# EAGLE design KimCard (EAGLE 5.08)
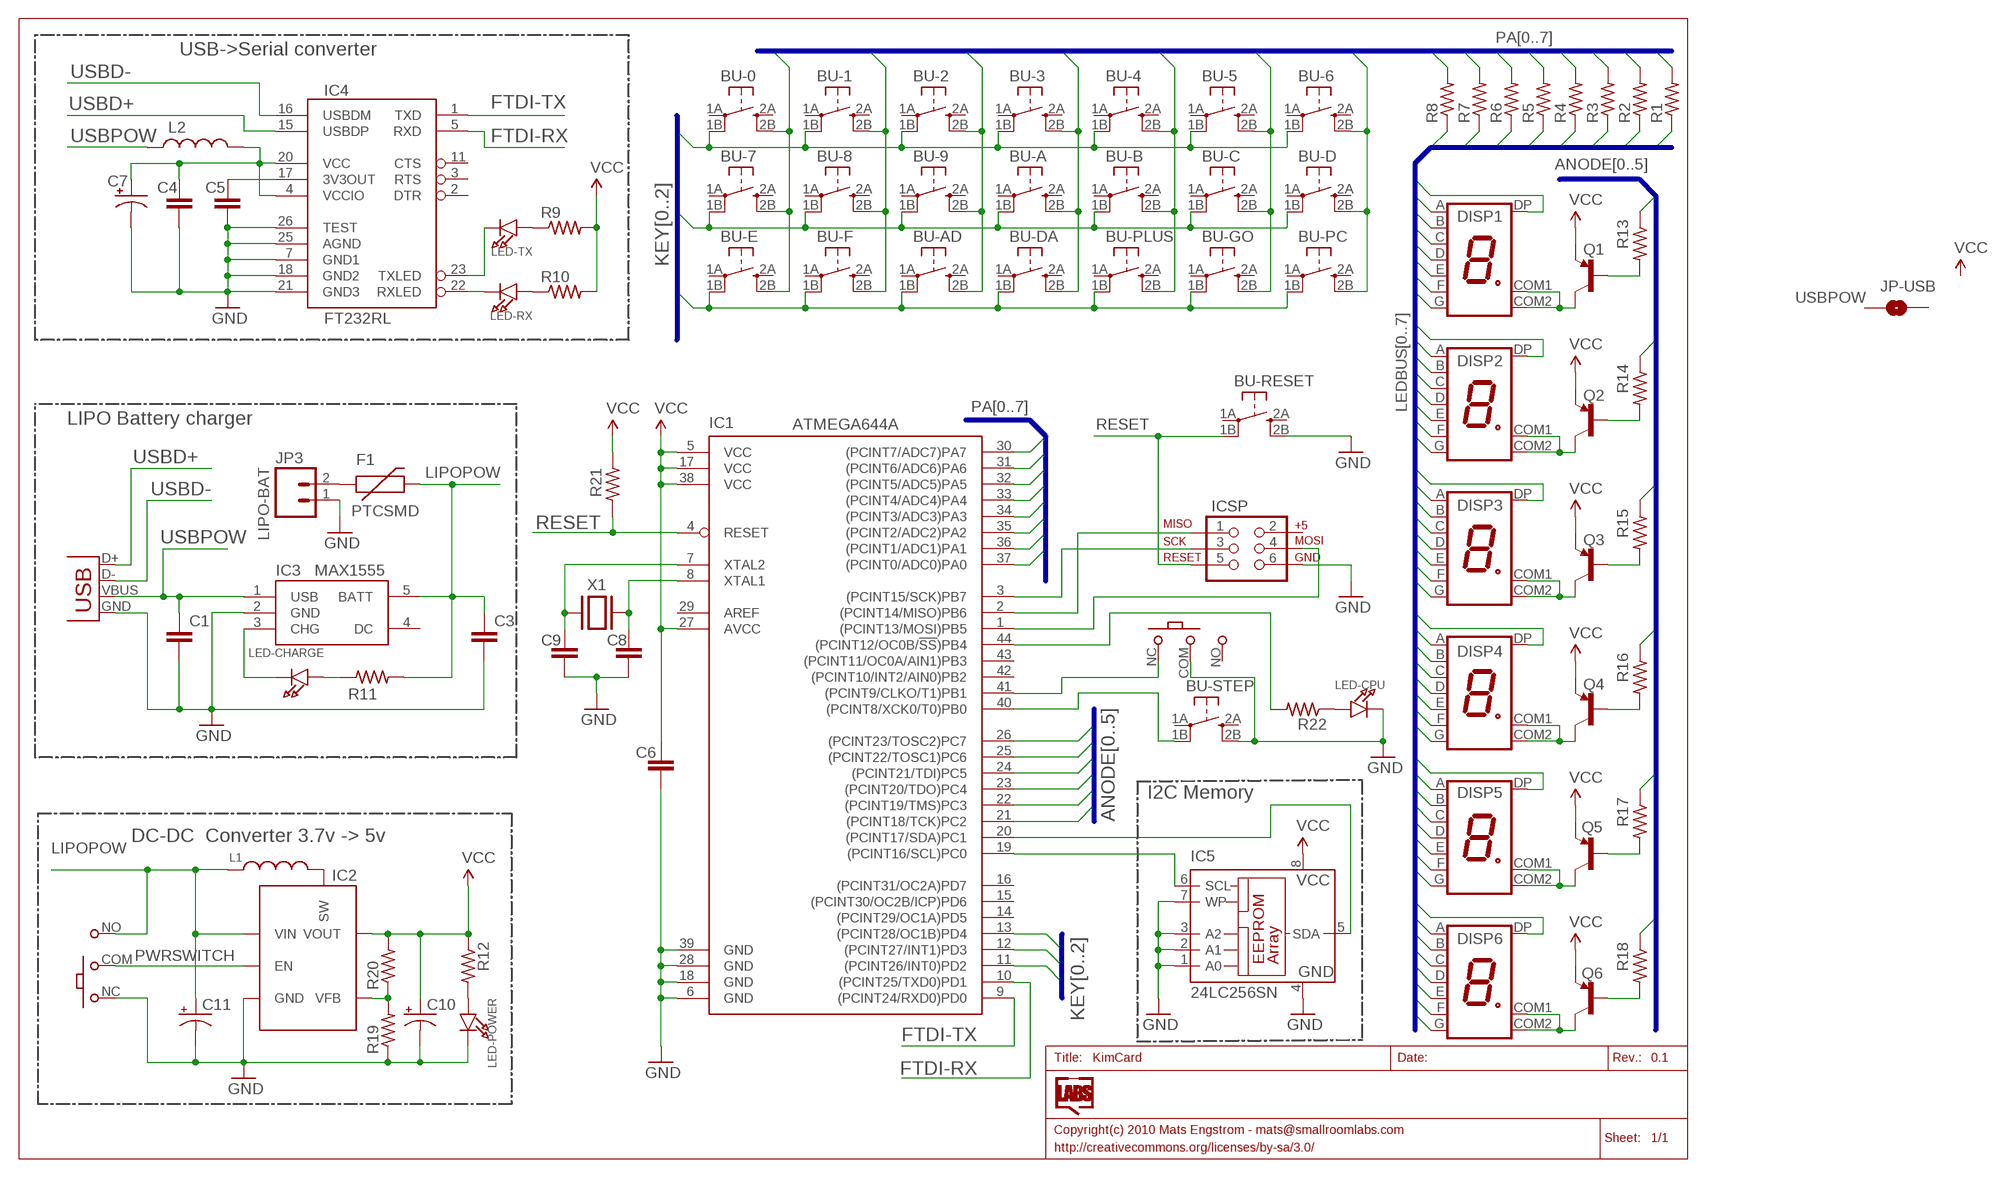
[diagram p0: schematic, sheet 1]

## Parts
BU-0  TACTILE  [EVQ-Q2]
BU-1  TACTILE  [EVQ-Q2]
BU-2  TACTILE  [EVQ-Q2]
BU-3  TACTILE  [EVQ-Q2]
BU-4  TACTILE  [EVQ-Q2]
BU-5  TACTILE  [EVQ-Q2]
BU-6  TACTILE  [EVQ-Q2]
BU-7  TACTILE  [EVQ-Q2]
BU-8  TACTILE  [EVQ-Q2]
BU-9  TACTILE  [EVQ-Q2]
BU-A  TACTILE  [EVQ-Q2]
BU-AD  TACTILE  [EVQ-Q2]
BU-B  TACTILE  [EVQ-Q2]
BU-C  TACTILE  [EVQ-Q2]
BU-D  TACTILE  [EVQ-Q2]
BU-DA  TACTILE  [EVQ-Q2]
BU-E  TACTILE  [EVQ-Q2]
BU-F  TACTILE  [EVQ-Q2]
BU-GO  TACTILE  [EVQ-Q2]
BU-PC  TACTILE  [EVQ-Q2]
BU-PLUS  TACTILE  [EVQ-Q2]
BU-RESET  TACTILE  [EVQ-Q2]
BU-STEP  TACTILE  [EVQ-Q2]
C1  CAP0805  [0805]
C3  CAP0805  [0805]
C4  CAP0603-CAP  [0603-CAP]
C5  CAP0603-CAP  [0603-CAP]
C6  CAP0603-CAP  [0603-CAP]
C7  CAP_POL1206  [EIA3216]
C8  CAP0603-CAP  [0603-CAP]
C9  CAP0603-CAP  [0603-CAP]
C10  CAP_POL1206  [EIA3216]
C11  CAP_POL1206  [EIA3216]
DISP1  7SEG  [TDS11]
DISP2  7SEG  [TDS11]
DISP3  7SEG  [TDS11]
DISP4  7SEG  [TDS11]
DISP5  7SEG  [TDS11]
DISP6  7SEG  [TDS11]
F1  PTCSMD  [PTC-1206]
IC1  ATMEGA644A  [TQFP44]
IC2  MCP1640SOT23-6  [SOT23-6]
IC3  MAX1555  [SOT23-5]
IC4  FT232RL  FT232RL-BASICSSOP  [SSOP28DB]
IC5  24LC256SN  [SO-08]
ICSP  AVR-ISP6AVRISP-EXTENED  [HEADER-2X3-EXTENDED]
JP1  USB-IN  USBSMD  [USB-MINIB]
JP3  LIPO-BAT  M02-JST-2MM-SMT  [S2B-PH]
JP-USB  SOLDERJUMPERNO  [SJ_2S-NO]
L1  INDUCTOR-VLCF  [VLCF]
L2  INDUCTOR0603  [0603]
LED-CHARGE  LEDSMD0805  [CHIPLED_0805]
LED-CPU  LEDSMD0805  [CHIPLED_0805]
LED-POWER  LEDSMD0805  [CHIPLED_0805]
LED-RX  LEDSMD0805  [CHIPLED_0805]
LED-TX  LEDSMD0805  [CHIPLED_0805]
Q1  TRANSISTOR_PNPSMD  [SOT23-3]
Q2  TRANSISTOR_PNPSMD  [SOT23-3]
Q3  TRANSISTOR_PNPSMD  [SOT23-3]
Q4  TRANSISTOR_PNPSMD  [SOT23-3]
Q5  TRANSISTOR_PNPSMD  [SOT23-3]
Q6  TRANSISTOR_PNPSMD  [SOT23-3]
R1  R-US_R0805  [R0805]
R2  R-US_R0805  [R0805]
R3  R-US_R0805  [R0805]
R4  R-US_R0805  [R0805]
R5  R-US_R0805  [R0805]
R6  R-US_R0805  [R0805]
R7  R-US_R0805  [R0805]
R8  R-US_R0805  [R0805]
R9  R-US_R0805  [R0805]
R10  R-US_R0805  [R0805]
R11  R-US_R0805  [R0805]
R12  R-US_R0805  [R0805]
R13  R-US_R0805  [R0805]
R14  R-US_R0805  [R0805]
R15  R-US_R0805  [R0805]
R16  R-US_R0805  [R0805]
R17  R-US_R0805  [R0805]
R18  R-US_R0805  [R0805]
R19  R-US_R0805  [R0805]
R20  R-US_R0805  [R0805]
R21  R-US_R0805  [R0805]
R22  R-US_R0805  [R0805]
U$1  SLIDESWITCHPCM12SMTR  [PCM12SMTR]
U$2  SLIDESWITCHPCM12SMTR  [PCM12SMTR]
X1  XTAL12SMX-B  [12SMX-B]

## Nets
FTDI-RX: IC1.10((PCINT25/TXD0)PD1) IC4.5(RXD)
FTDI-TX: IC1.9((PCINT24/RXD0)PD0) IC4.1(TXD)
GND [pwr2]: BU-RESET.2B BU-STEP.2B C1.2 C3.2 C4.2 C5.2 C6.1 C7.C(-) C8.1 C9.1 C10.C(-) C11.C(-) IC1.6(GND) IC1.18(GND) IC1.28(GND) IC1.39(GND) IC2.2(GND) IC3.2(GND) IC4.7(GND1) IC4.18(GND2) IC4.21(GND3) IC4.25(AGND) IC4.26(TEST) IC5.1(A0) IC5.2(A1) IC5.3(A2) IC5.4(GND) IC5.7(WP) ICSP.6(GND) JP1.GND JP3.1 LED-CPU.C LED-POWER.C R19.1 U$1.NC U$2.COM
KEYROW0: BU-0.1B BU-1.1B BU-2.1B BU-3.1B BU-4.1B BU-5.1B BU-6.1B IC1.11((PCINT26/INT0)PD2)
KEYROW1: BU-7.1B BU-8.1B BU-9.1B BU-A.1B BU-B.1B BU-C.1B BU-D.1B IC1.12((PCINT27/INT1)PD3)
KEYROW2: BU-AD.1B BU-DA.1B BU-E.1B BU-F.1B BU-GO.1B BU-PC.1B BU-PLUS.1B IC1.13((PCINT28/OC1B)PD4)
LEDBUS0: DISP1.A DISP2.A DISP3.A DISP4.A DISP5.A DISP6.A R1.1
LEDBUS1: DISP1.B DISP2.B DISP3.B DISP4.B DISP5.B DISP6.B R2.1
LEDBUS2: DISP1.C DISP2.C DISP3.C DISP4.C DISP5.C DISP6.C R3.1
LEDBUS3: DISP1.D DISP2.D DISP3.D DISP4.D DISP5.D DISP6.D R4.1
LEDBUS4: DISP1.E DISP2.E DISP3.E DISP4.E DISP5.E DISP6.E R5.1
LEDBUS5: DISP1.F DISP2.F DISP3.F DISP4.F DISP5.F DISP6.F R6.1
LEDBUS6: DISP1.G DISP2.G DISP3.G DISP4.G DISP5.G DISP6.G R7.1
LEDBUS7: DISP1.DP DISP2.DP DISP3.DP DISP4.DP DISP5.DP DISP6.DP R8.1
LEDCA0: IC1.21((PCINT18/TCK)PC2) R13.1
LEDCA1: IC1.22((PCINT19/TMS)PC3) R14.1
LEDCA2: IC1.23((PCINT20/TDO)PC4) R15.1
LEDCA3: IC1.24((PCINT21/TDI)PC5) R16.1
LEDCA4: IC1.25((PCINT22/TOSC1)PC6) R17.1
LEDCA5: IC1.26((PCINT23/TOSC2)PC7) R18.1
LIPO+ [pwr1]: F1.1 JP3.2
LIPOPOW [pwr2]: C3.1 C11.A(+) F1.2 IC2.6(VIN) IC3.5(BATT) L1.P$1 R11.2 U$1.NO
MISO: IC1.2((PCINT14/MISO)PB6) ICSP.1(MISO)
MOSI: IC1.1((PCINT13/MOSI)PB5) ICSP.4(MOSI)
N$1: IC2.1(SW) L1.P$2
N$2: IC1.41((PCINT9/CLKO/T1)PB1) U$2.NC
N$4: LED-TX.A R9.1
N$5: LED-RX.A R10.1
N$6: LED-POWER.A R12.2
N$7: LED-CPU.A R22.1
N$15: IC2.4(VFB) R19.2 R20.1
N$18: IC3.3(CHG) LED-CHARGE.C
N$19: BU-STEP.1B IC1.40((PCINT8/XCK0/T0)PB0)
N$21: C5.1 IC4.17(3V3OUT)
N$23: IC1.19((PCINT16/SCL)PC0) IC5.6(SCL)
N$24: IC1.20((PCINT17/SDA)PC1) IC5.5(SDA)
N$25: IC1.44((PCINT12/OC0B/!SS!)PB4) R22.2
N$29: IC4.22(RXLED) LED-RX.C
N$30: IC4.23(TXLED) LED-TX.C
PA0: BU-0.2B BU-7.2B BU-E.2B IC1.37((PCINT0/ADC0)PA0) R1.2
PA1: BU-1.2B BU-8.2B BU-F.2B IC1.36((PCINT1/ADC1)PA1) R2.2
PA2: BU-2.2B BU-9.2B BU-AD.2B IC1.35((PCINT2/ADC2)PA2) R3.2
PA3: BU-3.2B BU-A.2B BU-DA.2B IC1.34((PCINT3/ADC3)PA3) R4.2
PA4: BU-4.2B BU-B.2B BU-PLUS.2B IC1.33((PCINT4/ADC4)PA4) R5.2
PA5: BU-5.2B BU-C.2B BU-GO.2B IC1.32((PCINT5/ADC5)PA5) R6.2
PA6: BU-6.2B BU-D.2B BU-PC.2B IC1.31((PCINT6/ADC6)PA6) R7.2
PA7: IC1.30((PCINT7/ADC7)PA7) R8.2
PWRSWITCH: IC2.3(EN) U$1.COM
Q1B: Q1.1(B) R13.2
Q1C: DISP1.COM1(CA) DISP1.COM2(CA) Q1.3(C)
Q2B: Q2.1(B) R14.2
Q2C: DISP2.COM1(CA) DISP2.COM2(CA) Q2.3(C)
Q3B: Q3.1(B) R15.2
Q3C: DISP3.COM1(CA) DISP3.COM2(CA) Q3.3(C)
Q4B: Q4.1(B) R16.2
Q4C: DISP4.COM1(CA) DISP4.COM2(CA) Q4.3(C)
Q5B: Q5.1(B) R17.2
Q5C: DISP5.COM1(CA) DISP5.COM2(CA) Q5.3(C)
Q6B: Q6.1(B) R18.2
Q6C: DISP6.COM1(CA) DISP6.COM2(CA) Q6.3(C)
RESET: BU-RESET.1B IC1.4(RESET) ICSP.5(RESET) R21.1
RL3: LED-CHARGE.A R11.1
SCK: IC1.3((PCINT15/SCK)PB7) ICSP.3(SCK)
USB-VCC2: C4.1 C7.A(+) IC4.4(VCCIO) IC4.20(VCC) L2.2
USBD+: IC4.15(USBDP) JP1.D+
USBD-: IC4.16(USBDM) JP1.D-
USBPOW [pwr1]: C1.1 IC3.1(USB) JP1.VBUS L2.1
VCC [pwr1]: C6.2 C10.A(+) IC1.5(VCC) IC1.17(VCC) IC1.27(AVCC) IC1.38(VCC) IC2.5(VOUT) IC5.8(VCC) Q1.2(E) Q2.2(E) Q3.2(E) Q4.2(E) Q5.2(E) Q6.2(E) R9.2 R10.2 R12.1 R20.2 R21.2
XTAL1: C9.2 IC1.7(XTAL2) X1.XTAL1
XTAL2: C8.2 IC1.8(XTAL1) X1.XTAL2
Unconnected: BU-0.1A BU-0.2A BU-1.1A BU-1.2A BU-2.1A BU-2.2A BU-3.1A BU-3.2A BU-4.1A BU-4.2A BU-5.1A BU-5.2A BU-6.1A BU-6.2A BU-7.1A BU-7.2A BU-8.1A BU-8.2A BU-9.1A BU-9.2A BU-A.1A BU-A.2A BU-AD.1A BU-AD.2A BU-B.1A BU-B.2A BU-C.1A BU-C.2A BU-D.1A BU-D.2A BU-DA.1A BU-DA.2A BU-E.1A BU-E.2A BU-F.1A BU-F.2A BU-GO.1A BU-GO.2A BU-PC.1A BU-PC.2A BU-PLUS.1A BU-PLUS.2A BU-RESET.1A BU-RESET.2A BU-STEP.1A BU-STEP.2A IC1.14((PCINT29/OC1A)PD5) IC1.15((PCINT30/OC2B/ICP)PD6) IC1.16((PCINT31/OC2A)PD7) IC1.29(AREF) IC1.42((PCINT10/INT2/AIN0)PB2) IC1.43((PCINT11/OC0A/AIN1)PB3) IC3.4(DC) IC4.2(DTR) IC4.3(RTS) IC4.11(CTS) ICSP.2(V+) JP-USB.1 JP-USB.2 U$2.NO

## Buses
LEDBUS[0..7]
PA[0..7]
ANODE[0..5]
KEY[0..2]

## Notes on the sheet
- USB->Serial converter
- LIPO Battery charger
- I2C Memory
- DC-DC  Converter 3.7v -> 5v

## Library data of the parts
BU-0 BU-1-BU-9 BU-A BU-AD BU-B BU-C BU-D BU-DA BU-E BU-F BU-GO BU-PC BU-PLUS BU-RESET BU-STEP = SmallRoomLabs:TACTILE
C1 C3-C6 C8 C9 = SparkFun:CAP: Capacitor Standard 0603 ceramic capacitor, and 0.1" leaded capacitor.
C7 C10 C11 = SparkFun:CAP_POL: Capacitor Polarized These are standard SMD and PTH capacitors. Normally 10uF, 47uF, and 100uF in electrolytic and tantalum varieties. Always verify the external diameter of the through hole cap, it varies with capacity, voltage, and manufacturer. The EIA devices should be standard.
DISP1-DISP6 = Nerdlabs:7SEG
F1 = SparkFun:PTC: Resettable Fuse PTC Resettable Fuse. Spark Fun Electronics SKU : COM-08357
IC1 = atmel:ATMEGA644: 8-bit Microcontroller with 64K Bytes In-System Programmable Flash Source: http://www.atmel.com/dyn/resources/prod_documents/doc2593.pdf
IC2 = SmallRoomLabs:MCP1640
IC3 = SparkFun:MAX1555: MAX1555 Lithium Charger IC SOT-23 Lithium Polymer charging IC. Schematic element and footprint proven. Spark Fun Electronics SKU : COM-00674
IC4 = SparkFun:FT232RL-BASIC: USB UART This is the simplified version of the FT232RL unit. Only what you need, nothing you don't. Spark Fun Electronics SKU : COM-00650
IC5 = microchip:24*: Serial EEPROM I2C
ICSP = SmallRoomLabs:AVR-ISP6
JP1 = SparkFun:USB: USB Connectors USB-B-PTH is fully proven SKU : PRT-00139 USB-miniB is fully proven SKU : PRT-00587 USB-A-PCB is untested. USB-A-H is throughly reviewed, but untested. Spark Fun Electronics SKU : PRT-00437 USB-B-SMT is throughly reviewed, but untested. Needs silkscreen touching up. USB-A-S has not been used/tested USB-MB-H has not been used/tested
JP3 = SparkFun:M02: Header 2 Standard 2-pin 0.1" header. Use with straight break away headers (SKU : PRT-00116), right angle break away headers (PRT-00553), swiss pins (PRT-00743), machine pins (PRT-00117), and female headers (PRT-00115). Molex polarized connector foot print use with SKU : PRT-08233 with associated crimp pins and housings.
JP-USB = SparkFun:SOLDERJUMPER: Solder Jumper Standard SMD solder jumper. Used to automate production. Two varients : Normally Open and Normally Closed are the same, but have different paste layers. NC will have a large amount of paste and should jumper during reflow.
L1 = Nerdlabs:INDUCTOR
L2 = SparkFun:INDUCTOR: Inductors Basic Inductor/Choke - 0603 and 1206. Footprints are not proven and vary greatly between part numbers.
LED-CHARGE LED-CPU LED-POWER LED-RX LED-TX = SmallRoomLabs:LED
Q1-Q6 = SparkFun:TRANSISTOR_PNP
R1-R22 = adafruit:R-US_: RESISTOR, American symbol
U$1 U$2 = Nerdlabs:SLIDESWITCH
X1 = SmallRoomLabs:XTAL

## Net classes
0 default: width 0.203 mm, drill 0.203 mm, clearance 0.203 mm
1 pwr1: width 0.254 mm, clearance 0.203 mm
2 gnd1: width 0.254 mm, clearance 0.203 mm
3 pwr2: width 0.254 mm, clearance 0.203 mm

## Board
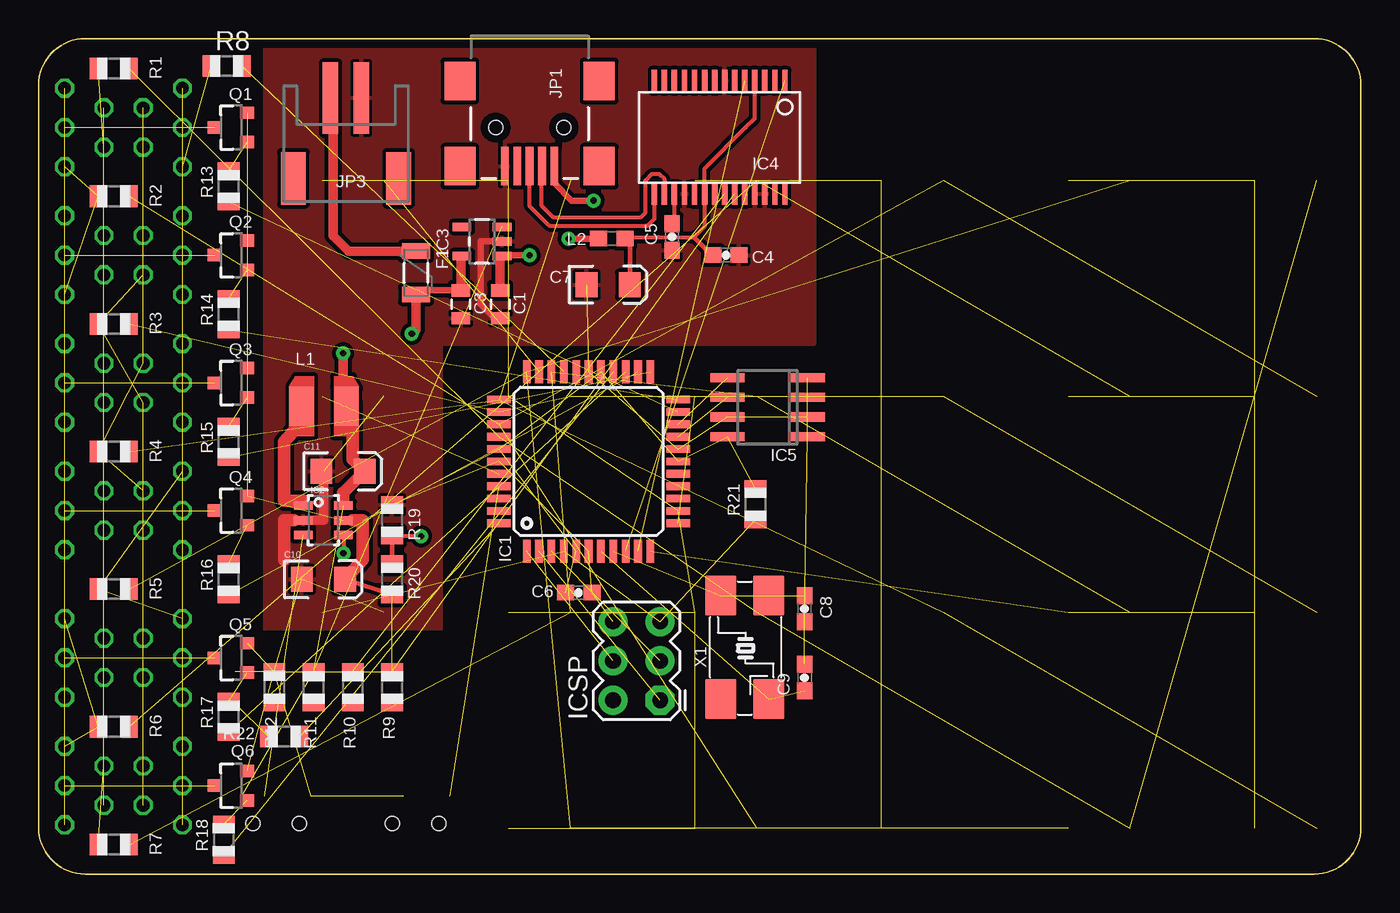
[diagram p1: board, top side]
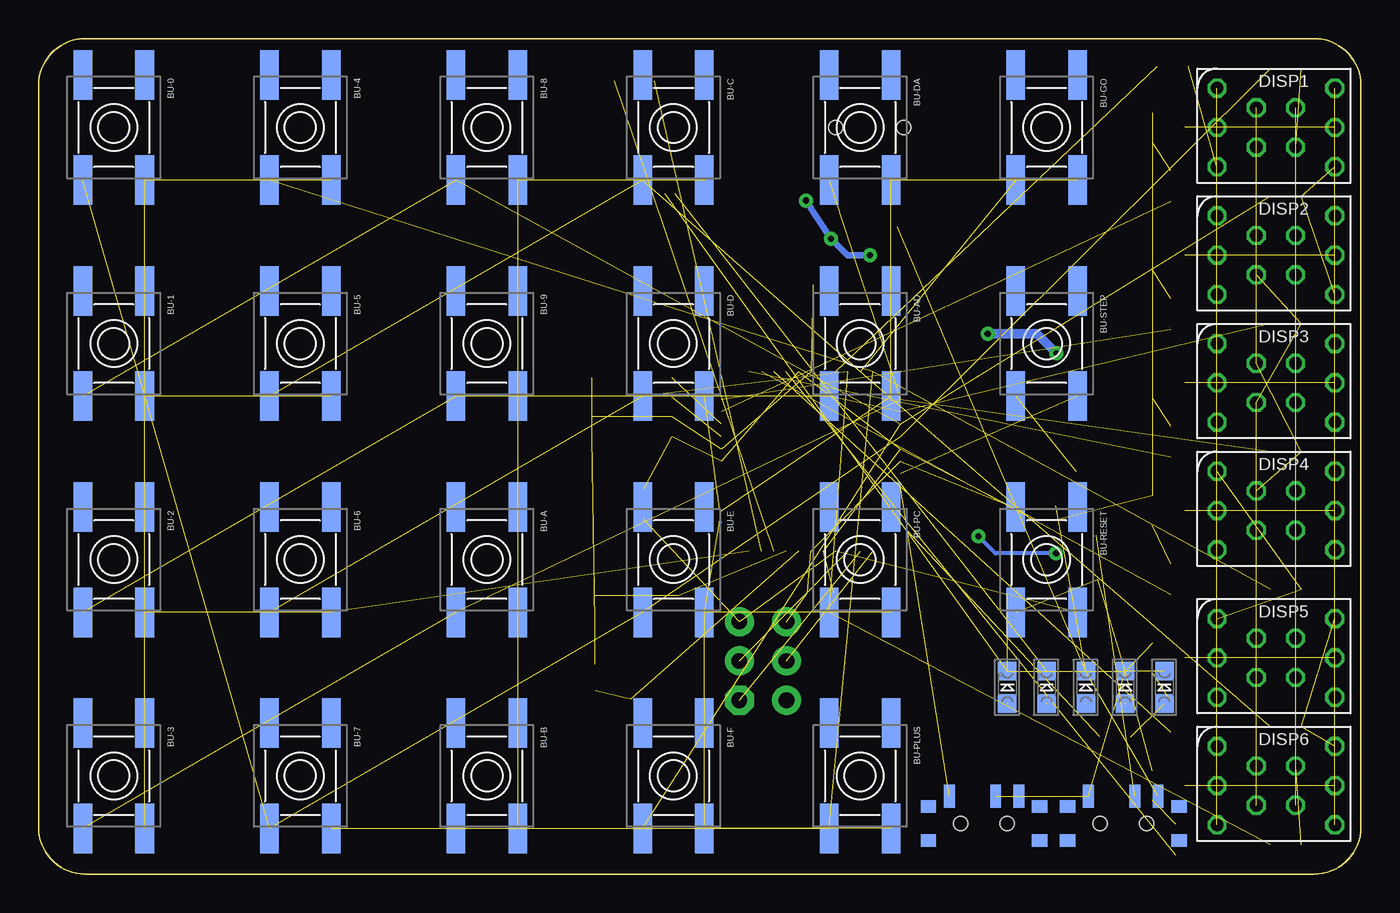
[diagram p2: board, bottom side, seen from below]

Size 85.5 x 54 mm. Coordinates in mm from the lower left corner, seen from the top.
Outline: 85.5,3 arc-90 82.5,0 3,0 arc-90 0,3 0,51 arc-90 3,54 82.5,54 arc-90 85.5,51 85.5,3
Copper layers (1*16): Top 0.035mm / dielectric 1.5mm / Bottom 0.035mm
Design rules "PCBCart-microbuilder": minimum track width 8mil, minimum drill 0.4mm, track to track 8mil, track to pad 8mil, pad to pad 8mil, via to via 8mil, smd to smd 8mil, copper to edge 20mil, drill to drill 8mil, minimum pad ring 8mil, minimum via ring 10mil, stop-mask expansion 3mil, vias tented up to drill 0mil, thermal gap 8mil

### Footprints (pad centres in the part's own frame; a part is rotated, then mirrored left to right if it is on the bottom)
EVQ-Q2 = smd 3.2 x 1.2: 1A -3.4,2; 1B 3.4,2; 2A -3.4,-2; 2B 3.4,-2
0805 = smd 0.8 x 1.2: 1 -0.9,0; 2 0.9,0
0603-CAP = smd 1.1 x 1: 1 -0.85,0; 2 0.85,0
EIA3216 = smd 1.4 x 1.6: A 1.4,0; C -1.4,0
TDS11 = drill 0.813 octagon: A 1.27,1.27; B 2.54,3.81; C 1.27,-1.27; COM1 0,-3.81; COM2 0,3.81; D -1.27,-1.27; DP 2.54,-3.81; E -2.54,-3.81; F -2.54,3.81; G -1.27,1.27
PTC-1206 = smd 1 x 1.8: 1 -1.4,0; 2 1.4,0
TQFP44 = smd 1.5 x 0.5: 1 -5.8,4; 2 -5.8,3.2; 3 -5.8,2.4; 4 -5.8,1.6; 5 -5.8,0.8; 6 -5.8,0; 7 -5.8,-0.8; 8 -5.8,-1.6; 9 -5.8,-2.4; 10 -5.8,-3.2; 11 -5.8,-4; 23 5.8,-4; 24 5.8,-3.2; 25 5.8,-2.4; 26 5.8,-1.6; 27 5.8,-0.8; 28 5.8,0; 29 5.8,0.8; 30 5.8,1.6; 31 5.8,2.4; 32 5.8,3.2; 33 5.8,4 | smd 0.5 x 1.5: 12 -4,-5.8; 13 -3.2,-5.8; 14 -2.4,-5.8; 15 -1.6,-5.8; 16 -0.8,-5.8; 17 0,-5.8; 18 0.8,-5.8; 19 1.6,-5.8; 20 2.4,-5.8; 21 3.2,-5.8; 22 4,-5.8; 34 4,5.8; 35 3.2,5.8; 36 2.4,5.8; 37 1.6,5.8; 38 0.8,5.8; 39 0,5.8; 40 -0.8,5.8; 41 -1.6,5.8; 42 -2.4,5.8; 43 -3.2,5.8; 44 -4,5.8
SOT23-6 = smd 0.55 x 1.2: 1 0.32,-1.3; 2 1.27,-1.3; 3 2.22,-1.3; 4 2.22,1.3; 5 1.27,1.3; 6 0.32,1.3
SOT23-5 = smd 0.55 x 1.2: 1 -0.95,-1.3; 2 0,-1.3; 3 0.95,-1.3; 4 0.95,1.3; 5 -0.95,1.3
SSOP28DB = smd 0.348 x 1.397: 1 -4.225,-3.656; 2 -3.575,-3.656; 3 -2.925,-3.656; 4 -2.275,-3.656; 5 -1.625,-3.656; 6 -0.975,-3.656; 7 -0.325,-3.656; 8 0.325,-3.656; 9 0.975,-3.656; 10 1.625,-3.656; 11 2.275,-3.656; 12 2.925,-3.656; 13 3.575,-3.656; 14 4.225,-3.656; 15 4.225,3.656; 16 3.575,3.656; 17 2.925,3.656; 18 2.275,3.656; 19 1.625,3.656; 20 0.975,3.656; 21 0.325,3.656; 22 -0.325,3.656; 23 -0.975,3.656; 24 -1.625,3.656; 25 -2.275,3.656; 26 -2.925,3.656; 27 -3.575,3.656; 28 -4.225,3.656
SO-08 = smd 0.6 x 2.2: 1 -1.905,-2.6; 2 -0.635,-2.6; 3 0.635,-2.6; 4 1.905,-2.6; 5 1.905,2.6; 6 0.635,2.6; 7 -0.635,2.6; 8 -1.905,2.6
HEADER-2X3-EXTENDED = drill 1.016 pad 1.88 octagon: 1 -2.54,-1.27 | drill 1.016 pad 1.88 round: 2 -2.54,1.778; 3 0,-1.27; 4 0,1.778; 5 2.54,-1.27; 6 2.54,1.778
USB-MINIB = smd 2.5 x 0.5: D+ 2.5,0; D- 2.5,0.8; GND 2.5,-1.6; ID 2.5,-0.8; VBUS 2.5,1.6 | smd 2.5 x 2: GND@1 -3,-4.5; GND@2 -3,4.5; GND@3 2.5,4.5; GND@4 2.5,-4.5 | hole 0.9: 0,2.2; 0,-2.2
S2B-PH = smd 1 x 4.6: 1 -1,-3.7; 2 1,-3.7 | smd 1.6 x 3.4: NC1 -3.4,1.5; NC2 3.4,1.5
SJ_2S-NO = smd 0.635 x 1.27: 1 -0.45,0; 2 0.45,0
VLCF = smd 2.5 x 1.6: P$1 0,1.45; P$2 0,-1.45
0603 = smd 1.1 x 1: 1 -0.85,0; 2 0.85,0
CHIPLED_0805 = smd 1.2 x 1.2: A 0,-1.05; C 0,1.05
SOT23-3 = smd 0.8 x 0.9: 1 -0.95,-1; 2 0.95,-1; 3 0,1.1
R0805 = smd 1.1 x 1.4: 1 -1,0; 2 1,0
PCM12SMTR = smd 0.7 x 1.5: COM 0.75,1.75; NC -2.25,1.75; NO 2.25,1.75 | smd 1 x 0.8: P$1 -3.6,-1.1; P$2 -3.6,1.1; P$3 3.6,1.1; P$4 3.6,-1.1 | hole 0.9: -1.5,0; 1.5,0
12SMX-B = smd 2.6 x 2: NU1 -3.3,1.6; NU2 3.4,-1.5; XTAL1 -3.3,-1.5; XTAL2 3.4,1.6

### Placement (x,y rotation side)
BU-0  80.64,48.26 270 bottom
BU-1  80.64,34.29 270 bottom
BU-2  80.64,20.32 270 bottom
BU-3  80.64,6.35 270 bottom
BU-4  68.58,48.26 270 bottom
BU-5  68.58,34.29 270 bottom
BU-6  68.58,20.32 270 bottom
BU-7  68.58,6.35 270 bottom
BU-8  56.51,48.26 270 bottom
BU-9  56.51,34.29 270 bottom
BU-A  56.51,20.32 270 bottom
BU-AD  32.38,34.29 270 bottom
BU-B  56.51,6.35 270 bottom
BU-C  44.45,48.26 270 bottom
BU-D  44.45,34.29 270 bottom
BU-DA  32.38,48.26 270 bottom
BU-E  44.45,20.32 270 bottom
BU-F  44.45,6.35 270 bottom
BU-GO  20.32,48.26 270 bottom
BU-PC  32.38,20.32 270 bottom
BU-PLUS  32.38,6.35 270 bottom
BU-RESET  20.32,20.32 270 bottom
BU-STEP  20.32,34.29 270 bottom
C1  29.84,36.83 270 top
C3  27.3,36.83 270 top
C4  44.45,40.01 0 top
C5  40.96,41.18 270 top
C6  34.92,18.19 180 top
C7  36.83,38.1 0 top
C8  49.53,17.14 90 top
C9  49.53,12.7 270 top
C10  18.41,19.05 0 top
C11  19.68,26.04 0 top
DISP1  5.49,48.26 270 bottom
DISP2  5.49,40.01 270 bottom
DISP3  5.49,31.75 270 bottom
DISP4  5.49,23.5 270 bottom
DISP5  5.49,13.97 270 bottom
DISP6  5.49,5.71 270 bottom
F1  24.4,38.86 270 top
IC1  35.56,26.67 90 top
IC2  18.41,24.13 270 top
IC3  28.67,40.89 90 top
IC4  44.04,47.62 180 top
IC5  47.13,30.18 90 top
ICSP  38.92,13.78 90 top
JP1  31.75,48.26 270 top
JP3  19.88,46.47 180 top
JP-USB  59.05,60.96 270 top  (outside the outline)
L1  18.45,30.24 270 top
L2  37.06,41.07 0 top
LED-CHARGE  17.78,12.06 0 bottom
LED-CPU  12.7,12.06 0 bottom
LED-POWER  15.24,12.06 0 bottom
LED-RX  20.32,12.06 0 bottom
LED-TX  22.86,12.06 0 bottom
Q1  12.47,48.26 90 top
Q2  12.47,40.01 90 top
Q3  12.47,31.75 90 top
Q4  12.47,23.5 90 top
Q5  12.47,13.97 90 top
Q6  12.47,5.71 90 top
R1  4.85,52.07 0 top
R2  4.85,43.81 0 top
R3  4.85,35.56 0 top
R4  4.85,27.3 0 top
R5  4.85,18.41 0 top
R6  4.85,9.53 0 top
R7  4.85,1.91 0 top
R8  12.16,52.23 0 top
R9  22.86,12.06 90 top
R10  20.32,12.06 90 top
R11  17.78,12.06 90 top
R12  15.24,12.06 270 top
R13  12.29,44.45 90 top
R14  12.29,36.2 90 top
R15  12.29,27.94 90 top
R16  12.29,19.05 90 top
R17  12.29,10.16 90 top
R18  11.97,2.22 90 top
R19  22.86,22.86 270 top
R20  22.86,19.05 270 top
R21  46.35,23.91 90 top
R22  15.87,8.89 0 top
U$1  15.36,3.27 0 bottom
U$2  24.36,3.27 0 bottom
X1  45.72,14.61 90 top

### Tracks (layer width: path | path; a pad name or v marks a point on that pad's centre or on a via)
FTDI-RX  (1 unrouted)
FTDI-TX  (1 unrouted)
GND  (19 unrouted)
  Top 0.305: 16.51,22.86 IC2.2
  Top 0.406: 28.57,40.89 IC3.2 | 29.47,35.93 28.57,36.83 28.57,40.89 | 28.57,40.89
  Top 0.61: 18.41,26.04 18.41,22.86 IC2.2
  Top 0.813: 16.51,22.86 15.87,22.86 15.87,20.32
  pour Top (isolate 0.254): 14.6,53.34 14.6,34.29 50.16,34.29 50.16,53.34
  pour Top (isolate 0.254): 14.6,34.29 14.6,15.88 26.03,15.88 26.03,34.29
KEYROW0  (7 unrouted)
KEYROW1  (7 unrouted)
KEYROW2  (7 unrouted)
LEDBUS0  (6 unrouted)
LEDBUS1  (6 unrouted)
LEDBUS2  (6 unrouted)
LEDBUS3  (6 unrouted)
LEDBUS4  (6 unrouted)
LEDBUS5  (6 unrouted)
LEDBUS6  (6 unrouted)
LEDBUS7  (6 unrouted)
LEDCA0  (1 unrouted)
LEDCA1  (1 unrouted)
LEDCA2  (1 unrouted)
LEDCA3  (1 unrouted)
LEDCA4  (1 unrouted)
LEDCA5  (1 unrouted)
LIPO+
  Top 0.406: 19.05,50 JP3.2
  Top 0.61: F1.1 20.06,40.26 19.05,41.27 19.05,50
LIPOPOW  (via drill 0.4)  (2 unrouted)
  Top 0.305: 20.32,30.48 19.9,30.48 L1.P$1 | IC2.6 19.71,24.1 19.68,24.13
  Top 0.406: 27.3,39.88 IC3.5 | 19.9,30.48 19.9,31.53 | F1.2 24.66,37.73 C3.1
  Top 0.61: 27.3,39.88 C3.1 26.93,37.73 | F1.2 24.4,35.2 v24.13,34.92 | v19.68,33.66 19.68,31.75 19.9,31.53
  Top 0.813: 19.68,24.13 19.68,24.64 C11.A 20.32,26.8 20.32,30.48
  Bottom 0.61: v24.13,34.92 20.95,34.92 v19.68,33.66
MISO  (1 unrouted)
MOSI  (1 unrouted)
N$1
  Top 0.305: IC2.1 17.14,23.81 17.14,24.13
  Top 0.813: 17.14,24.13 15.87,24.13 15.87,27.94 17,29.21 L1.P$2
N$2  (1 unrouted)
N$4  (1 unrouted)
N$5  (1 unrouted)
N$6  (1 unrouted)
N$7  (1 unrouted)
N$15  (via drill 0.4)
  Top 0.254: IC2.4 v19.71,20.73 | v24.74,21.84 22.87,21.84 R19.2
  Top 0.305: R19.2 R20.1
  Bottom 0.254: v19.71,20.73 23.62,20.73 v24.74,21.84
N$18  (1 unrouted)
N$19  (1 unrouted)
N$21
  Top 0.254: C5.1 41.11,42.19 IC4.17
N$23  (1 unrouted)
N$24  (1 unrouted)
N$25  (1 unrouted)
N$29  (1 unrouted)
N$30  (1 unrouted)
PA0  (4 unrouted)
PA1  (4 unrouted)
PA2  (4 unrouted)
PA3  (4 unrouted)
PA4  (4 unrouted)
PA5  (4 unrouted)
PA6  (4 unrouted)
PA7  (1 unrouted)
PWRSWITCH  (1 unrouted)
Q1B  (1 unrouted)
Q1C  (2 unrouted)
Q2B  (1 unrouted)
Q2C  (2 unrouted)
Q3B  (1 unrouted)
Q3C  (2 unrouted)
Q4B  (1 unrouted)
Q4C  (2 unrouted)
Q5B  (1 unrouted)
Q5C  (2 unrouted)
Q6B  (1 unrouted)
Q6C  (2 unrouted)
RESET  (3 unrouted)
RL3  (1 unrouted)
SCK  (1 unrouted)
USB-VCC2
  Top 0.254: L2.2 arc-90 38.01,41.17 40.11,41.17 42.37,41.17 43.08,41.88 43.08,43.95 IC4.20 43.06,45.6 45.72,48.26 46.31,48.85 IC4.4
  Top 0.305: L2.2 38.23,40.75 C7.A | 42.37,41.17 43.53,40.01 C4.1
USBD+
  Top 0.254: JP1.D+ 31.75,43.18 33.02,41.91 39.37,41.91 39.81,42.35 IC4.15
USBD-
  Top 0.254: 32.55,45.73 JP1.D- 32.54,45.75 32.54,43.2 33.27,42.47 38.96,42.47 39.24,42.75 39.24,44.83 39.67,45.26 40.13,45.26 40.46,44.93 IC4.16
USBPOW  (via drill 0.4)
  Top 0.406: C1.1 29.97,37.85 | 29.84,39.75 29.84,39.82 IC3.1 30.03,40.01 v31.75,40.01 | JP1.VBUS 33.35,44.65 34.47,43.54 v35.89,43.54 | v34.26,41.07 L2.1
  Top 0.61: C1.1 29.84,39.75
  Bottom 0.406: v35.89,43.54 v34.26,41.07 33.2,40.01 v31.75,40.01
VCC  (16 unrouted)
  Top 0.305: C10.A R20.2
  Top 0.406: 20.32,22.86 IC2.5
  Top 0.813: 20.32,22.86 20.95,22.86 20.95,20.32 C10.A
XTAL1  (2 unrouted)
XTAL2  (2 unrouted)

### Text on the board
_bsilk: GO | AD | C | 8 | 4 | 0 | ST | DA | D | 9 | 5 | 1 | RS | PC | E | A | 6 | 2 | CPU | PWR | CHG | RX | TX | + | F | B | 7 | 3